# EAGLE design Placa 20.1.1 (EAGLE 9.4.2)

## Sheet 1 of 2
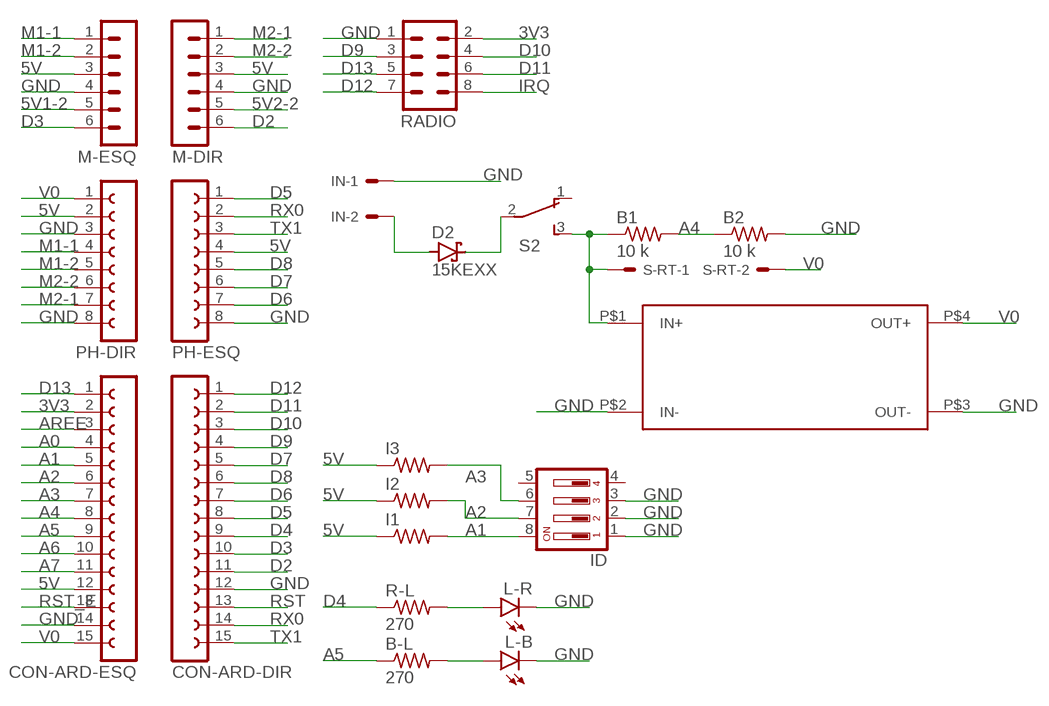
[diagram p0: schematic, sheet 1]

### Parts
B1  10 k  R-US_0207/10  [0207/10]
B2  10 k  R-US_0207/10  [0207/10]
B-L  270  R-US_0207/10  [0207/10]
CON-ARD-DIR  FE15-1  [FE15]
CON-ARD-ESQ  FE15-1  [FE15]
D2  15KEXX  [CB429-17]
I1  R-US_0207/10  [0207/10]
I2  R-US_0207/10  [0207/10]
I3  R-US_0207/10  [0207/10]
ID  DA04  [DA-04]
IN  332-02  [332-02]
L-B  LED5MM  [LED5MM]
L-R  LED5MM  [LED5MM]
M-DIR  MA06-1  [MA06-1]
M-ESQ  MA06-1  [MA06-1]
PH-DIR  FE08-1  [FE08]
PH-ESQ  FE08-1  [FE08]
R-L  270  R-US_0207/10  [0207/10]
RADIO  MA04-2  [MA04-2]
REGULADOR-DE-TENSÃO  REGULADOR  [REGULADOR-FP]
S2  TL36YO  [TL3XYO]
S-RT  332-02  [332-02]

### Nets
3V3: CON-ARD-ESQ.2 RADIO.2
5V: CON-ARD-ESQ.12 I1.1 I2.1 I3.1 M-DIR.3 M-ESQ.3 PH-DIR.2 PH-ESQ.4
5V1-2: M-ESQ.5
5V2-2: M-DIR.5
A0: CON-ARD-ESQ.4
A1: CON-ARD-ESQ.5 I1.2 ID.8
A2: CON-ARD-ESQ.6 I2.2 ID.7
A3: CON-ARD-ESQ.7 I3.2 ID.6
A4: B1.2 B2.1 CON-ARD-ESQ.8
A5: B-L.1 CON-ARD-ESQ.9
A6: CON-ARD-ESQ.10
A7: CON-ARD-ESQ.11
AREE: CON-ARD-ESQ.3
D2: CON-ARD-DIR.11 M-DIR.6
D3: CON-ARD-DIR.10 M-ESQ.6
D4: CON-ARD-DIR.9 R-L.1
D5: CON-ARD-DIR.8 PH-ESQ.1
D6: CON-ARD-DIR.7 PH-ESQ.7
D7: CON-ARD-DIR.5 PH-ESQ.6
D8: CON-ARD-DIR.6 PH-ESQ.5
D9: CON-ARD-DIR.4 RADIO.3
D10: CON-ARD-DIR.3 RADIO.4
D11: CON-ARD-DIR.2 RADIO.6
D12: CON-ARD-DIR.1 RADIO.7
D13: CON-ARD-ESQ.1 RADIO.5
GND: B2.2 CON-ARD-DIR.12 CON-ARD-ESQ.14 ID.1 ID.2 ID.3 IN.1 L-B.K(C) L-R.K(C) M-DIR.4 M-ESQ.4 PH-DIR.3 PH-DIR.8 PH-ESQ.8 RADIO.1 REGULADOR-DE-TENSÃO.P$2(IN-) REGULADOR-DE-TENSÃO.P$3(OUT-)
IRQ: RADIO.8
M1-1: M-ESQ.1 PH-DIR.4
M1-2: M-ESQ.2 PH-DIR.5
M2-1: M-DIR.1 PH-DIR.7
M2-2: M-DIR.2 PH-DIR.6
N$1: D2.A IN.2
N$2: D2.C S2.2(P)
N$3: B1.1 REGULADOR-DE-TENSÃO.P$1(IN+) S2.3(S) S-RT.1
N$4: L-R.A R-L.2
N$5: B-L.2 L-B.A
RST: CON-ARD-DIR.13
RST_E: CON-ARD-ESQ.13
RX0: CON-ARD-DIR.14 PH-ESQ.2
TX1: CON-ARD-DIR.15 PH-ESQ.3
V0: CON-ARD-ESQ.15 PH-DIR.1 REGULADOR-DE-TENSÃO.P$4(OUT+) S-RT.2
Unconnected: ID.4 ID.5 S2.1(O)

## Sheet 2 of 2

## Library data of the parts
B1 B2 B-L I1-I3 R-L = rcl:R-US_: RESISTOR, American symbol; SPICEPREFIX: R
CON-ARD-DIR = con-lsta:FE15-1: FEMALE HEADER; OC_FARNELL: unknown; OC_NEWARK: unknown
CON-ARD-ESQ = con-lsta:FE15-1: FEMALE HEADER; OC_FARNELL: unknown; OC_NEWARK: unknown; SPICEPREFIX: X
D2 = diode:15KEXX: DIODE
ID = switch-dil:DA04: DIL/CODE SWITCH; MPN: MCDA04; OC_FARNELL: 9471545; OC_NEWARK: 26M1090
IN S-RT = con-garry:332-02: 2 Pin - 2mm Dual Row Source: www.mpe-connector.de / garry_shortform_2012.pdf
L-B L-R = led:LED: LED OSRAM: - CHIPLED LG R971, LG N971, LY N971, LG Q971, LY Q971, LO R971, LY R971 LH N974, LH R974 LS Q976, LO Q976, LY Q976 LO Q996 - Hyper CHIPLED LW Q18S LB Q993, LB Q99A, LB R99A - SideLED LS A670, LO A670, LY A670, LG A670, LP A670 LB A673, LV A673, LT A673, LW A673 LH A674 LY A675 LS A676, LA A676, LO A676, LY A676, LW A676 LS A679, LY A679, LG A679 - Hyper Micro SIDELED® LS Y876, LA Y876, LO Y876, LY Y876 LT Y87S - SmartLED LW L88C, LW L88S LB L89C, LB L89S, LG L890 LS L89K, LO L89K, LY L89K LS L896, LA L896, LO L896, LY L896 - TOPLED LS T670, LO T670, LY T670, LG T670, LP T670 LSG T670, LSP T670, LSY T670, LOP T670, LYG T670 LG T671, LOG T671, LSG T671 LB T673, LV T673, LT T673, LW T673 LH T674 LS T676, LA T676, LO T676, LY T676, LB T676, LH T676, LSB T676, LW T676 LB T67C, LV T67C, LT T67C, LS T67K, LO T67K, LY T67K, LW E67C LS E67B, LA E67B, LO E67B, LY E67B, LB E67C, LV E67C, LT E67C LW T67C LS T679, LY T679, LG T679 LS T770, LO T770, LY T770, LG T770, LP T770 LB T773, LV T773, LT T773, LW T773 LH T774 LS E675, LA E675, LY E675, LS T675 LS T776, LA T776, LO T776, LY T776, LB T776 LHGB T686 LT T68C, LB T68C - Hyper Mini TOPLED® LB M676 - Mini TOPLED Santana® LG M470 LS M47K, LO M47K, LY M47K Source: http://www.osram.convergy.de LUXEON: - LUMILED® LXK2-PW12-R00, LXK2-PW12-S00, LXK2-PW14-U00, LXK2-PW14-V00 LXK2-PM12-R00, LXK2-PM12-S00, LXK2-PM14-U00 LXK2-PE12-Q00, LXK2-PE12-R00, LXK2-PE12-S00, LXK2-PE14-T00, LXK2-PE14-U00 LXK2-PB12-K00, LXK2-PB12-L00, LXK2-PB12-M00, LXK2-PB14-N00, LXK2-PB14-P00, LXK2-PB14-Q00 LXK2-PR12-L00, LXK2-PR12-M00, LXK2-PR14-Q00, LXK2-PR14-R00 LXK2-PD12-Q00, LXK2-PD12-R00, LXK2-PD12-S00 LXK2-PH12-R00, LXK2-PH12-S00 LXK2-PL12-P00, LXK2-PL12-Q00, LXK2-PL12-R00 Source: www.luxeon.com KINGBRIGHT: KA-3528ASYC Source: www.kingbright.com
M-DIR M-ESQ = con-lstb:MA06-1: PIN HEADER; OC_FARNELL: unknown; OC_NEWARK: unknown
PH-DIR PH-ESQ = con-lsta:FE08-1: FEMALE HEADER; OC_FARNELL: unknown; OC_NEWARK: unknown
RADIO = con-lstb:MA04-2: PIN HEADER; OC_FARNELL: unknown; OC_NEWARK: unknown
REGULADOR-DE-TENSÃO = robo-bdp:REGULADOR
S2 = switch:TL36YO: TINY SWITCH ON - ON Source: http://www2.produktinfo.conrad.com/datenblaetter/700000-724999/705152-da-01-de-Subminiaturschalter_TL_36YO.pdf

## Net classes
0 default: width 1 mm
1 VCC: width 1 mm

## Board
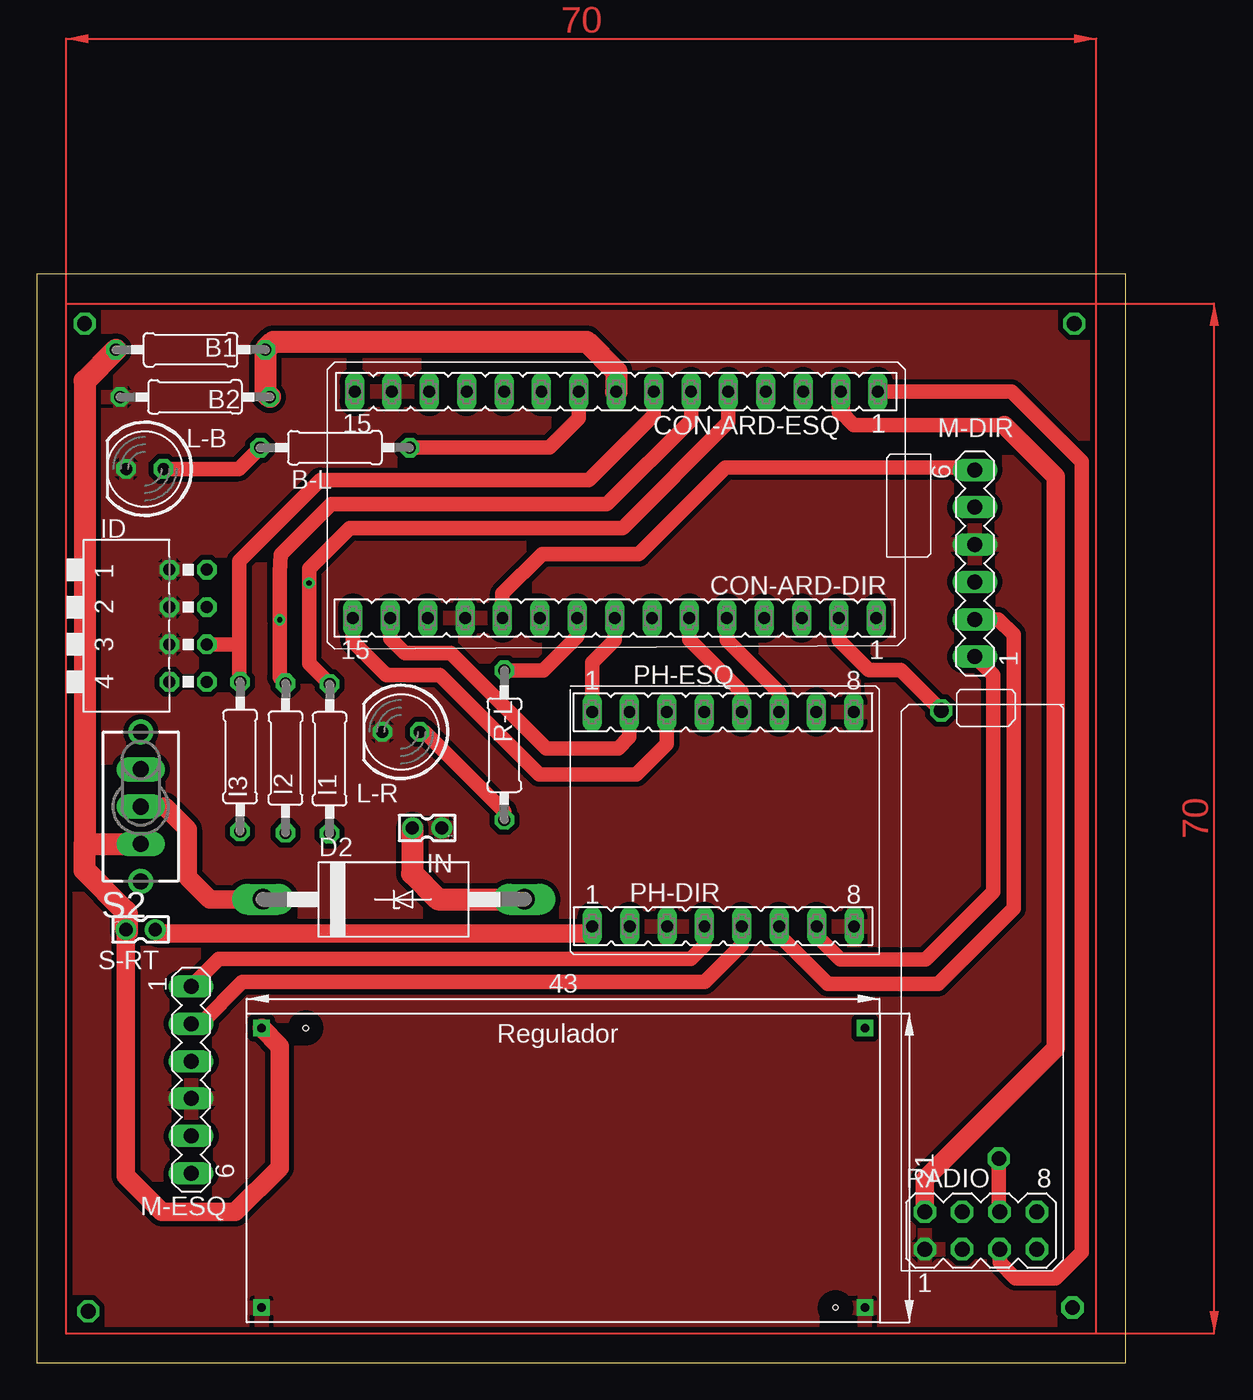
[diagram p1: board, top side]
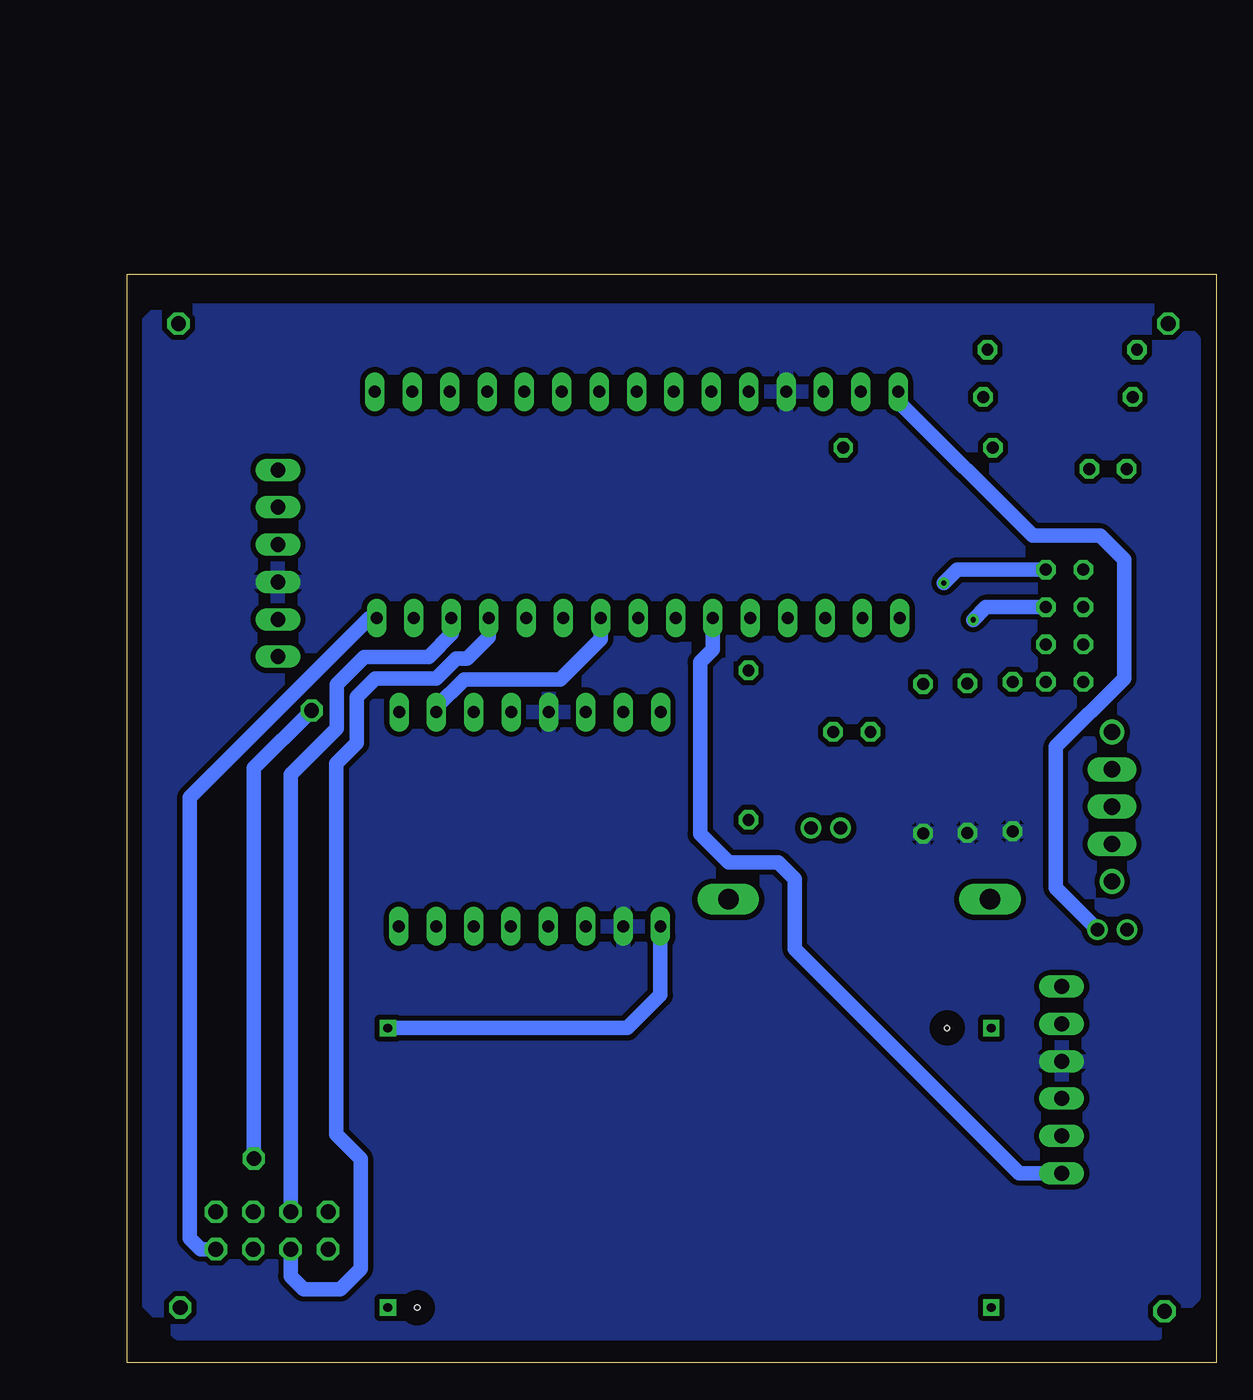
[diagram p2: board, bottom side, seen from below]

Size 74 x 74 mm. Coordinates in mm from the lower left corner, seen from the top.
Outline: 0,0 74,0 74,74 0,74 0,0
Copper layers (1*16): Top 0.035mm / dielectric 1.5mm / Bottom 0.035mm
Design rules "default *": minimum track width 6mil, minimum drill 0.35mm, track to track 14mil, track to pad 14mil, pad to pad 14mil, via to via 14mil, smd to smd 14mil, copper to edge 40mil, drill to drill 6mil, minimum pad ring 10mil, minimum via ring 8mil, stop-mask expansion 4mil, vias tented up to drill 0mil, thermal gap 10mil

### Footprints (pad centres in the part's own frame; a part is rotated, then mirrored left to right if it is on the bottom)
0207/10 = drill 0.813 octagon: 1 -5.08,0; 2 5.08,0
FE15 = drill 0.813 long: 1 -17.78,0; 2 -15.24,0; 3 -12.7,0; 4 -10.16,0; 5 -7.62,0; 6 -5.08,0; 7 -2.54,0; 8 0,0; 9 2.54,0; 10 5.08,0; 11 7.62,0; 12 10.16,0; 13 12.7,0; 14 15.24,0; 15 17.78,0
CB429-17 = drill 1.397 long: A 8.89,0; C -8.89,0
DA-04 = drill 0.813 octagon: 1 -3.81,-1.27; 2 -1.27,-1.27; 3 1.27,-1.27; 4 3.81,-1.27; 5 3.81,1.27; 6 1.27,1.27; 7 -1.27,1.27; 8 -3.81,1.27
332-02 = drill 0.9 pad 1.27: 1 0,-1; 2 0,1
LED5MM = drill 0.813 octagon: A -1.27,0; K 1.27,0
MA06-1 = drill 1.016 long: 1 -6.35,0; 2 -3.81,0; 3 -1.27,0; 4 1.27,0; 5 3.81,0; 6 6.35,0
FE08 = drill 0.813 long: 1 -8.89,0; 2 -6.35,0; 3 -3.81,0; 4 -1.27,0; 5 1.27,0; 6 3.81,0; 7 6.35,0; 8 8.89,0
MA04-2 = drill 1.016 octagon: 1 -3.81,-1.27; 2 -3.81,1.27; 3 -1.27,-1.27; 4 -1.27,1.27; 5 1.27,-1.27; 6 1.27,1.27; 7 3.81,-1.27; 8 3.81,1.27
REGULADOR-FP = drill 0.6 square: P$1 -19,3; P$2 -19,-16; P$3 22,-16; P$4 22,3 | hole 0.35: -16,3; 20,-16
TL3XYO = drill 1.1 pad 1.422 long: 1 -2.54,0; 2 0,0; 3 2.54,0 | drill 1.1 pad 1.676: M1 -5.08,0; M2 5.08,0

### Placement (x,y rotation side)
B1  10.45,68.85 0 top
B2  10.75,65.65 180 top
B-L  20.25,62.2 180 top
CON-ARD-DIR  39.26,50.62 180 top
CON-ARD-ESQ  39.37,66.01 180 top
D2  24.25,31.5 0 top
I1  19.9,41.05 90 top
I2  16.9,41.1 90 top
I3  13.82,41.2 90 top
ID  10.29,50.09 270 top
IN  26.52,36.35 90 top
L-B  7.34,60.76 180 top
L-R  24.75,42.88 180 top
M-DIR  63.74,54.34 90 top
M-ESQ  10.49,19.23 270 top
PH-DIR  46.64,29.67 0 top
PH-ESQ  46.62,44.23 0 top
R-L  31.77,41.98 270 top
RADIO  64.15,8.99 0 top
REGULADOR-DE-TENSÃO  34.27,19.75 0 top
S2  7.06,37.8 270 top
S-RT  7.06,29.44 270 top

### Tracks (layer width: path | path; a pad name or v marks a point on that pad's centre or on a via)
3V3
  Top 1: 54.61,64.64 55.5,63.75 65.75,63.75
  Top 1.27: 54.61,64.64 CON-ARD-ESQ.2 | 65.75,63.75 69.25,60.25 69.25,21.38 60.34,12.46 RADIO.2
5V
  pour Bottom: 4,2 70.5,2 73,4.5 73,70.25 71.75,71.5 3.5,71.5 1.5,69.5 1.5,4.5
A1  (via drill 0.35)
  Top 1: CON-ARD-ESQ.5 46.99,63.92 39.82,56.75 21.25,56.75 18.5,54 v18.5,53 18.5,47.53 I1.2
  Bottom 1: v18.5,53 17.6,53.9 ID.8
A2  (via drill 0.35)
  Top 1: CON-ARD-ESQ.6 44.45,64.09 38.74,58.38 20,58.38 16.56,54.94 16.5,53.75 v16.5,50.5 16.5,46.58 I2.2
  Bottom 1: ID.7 15.64,51.36 v16.5,50.5
A3
  Top 1: CON-ARD-ESQ.7 41.91,64.41 37.5,60 19.25,60 13.75,54.5 13.75,49 | 13.75,49 13.75,46.35 I3.2 | ID.6 13.57,48.82 13.75,49
A4
  Top 1.5: B2.1 15.53,65.95 B1.2 16.07,69.39 37.36,69.39 39.38,67.38 CON-ARD-ESQ.8
A5
  Top 1: CON-ARD-ESQ.9 36.83,64.21 34.82,62.2 B-L.1
D2
  Top 1: CON-ARD-DIR.11 31.64,52.27 34.34,54.97 40.91,54.97 46.78,60.84 63.59,60.84 M-DIR.6
D3
  Bottom 1: M-ESQ.6 13.38,12.88 28.62,28.12 28.62,32.88 29.75,34 33.12,34 35.06,35.93 35.06,47.62 34.18,48.49 CON-ARD-DIR.10
D4
  Top 1: CON-ARD-DIR.9 36.72,49.37 34.42,47.06 R-L.1
D5
  Top 1: CON-ARD-DIR.8 39.26,49.12 37.73,47.59 PH-ESQ.1
D6
  Bottom 1: CON-ARD-DIR.7 41.8,49.2 44.55,46.45 51.08,46.45 52.97,44.56 PH-ESQ.7
D7
  Top 1: CON-ARD-DIR.5 46.88,49.12 50.43,45.57 PH-ESQ.6
D8
  Top 1: CON-ARD-DIR.6 44.34,49.16 47.89,45.61 PH-ESQ.5
D9
  Bottom 1: RADIO.3 62.88,5.88 62,5 59.5,5 58.12,6.38 58.12,13.88 59.77,15.52 59.77,40.73 58.38,42.12 58.38,45.25 57.12,46.5 53,46.5 51.64,47.86 50.89,47.86 49.42,49.33 CON-ARD-DIR.4
D10
  Bottom 1: RADIO.4 62.88,39.99 59.76,43.12 59.76,46.11 57.88,47.98 53.51,47.98 51.94,49.56 51.94,50.59 CON-ARD-DIR.3
D11  (via drill 1, 1 pad 1.3)
  Top 1: v61.46,44.33 58.71,47.08 56.54,47.08 54.5,49.12 CON-ARD-DIR.2 | v65.38,13.88 65.38,10.3 RADIO.6
  Bottom 1: v61.46,44.33 65.38,40.42 v65.38,13.88
D12
  Bottom 1: RADIO.7 69,7.72 69.75,8.47 69.75,38.41 57.54,50.62 CON-ARD-DIR.1
D13
  Top 1: CON-ARD-ESQ.1 66.24,66.01 71,61.25 71,7.5 69.25,5.75 66.5,5.75 65.42,6.83 RADIO.5
GND
  pour Top: 4,2 70.5,2 73,4.5 73,70.5 72,71.5 3.5,71.5 2,70 2,4
M1-1
  Top 1: M-ESQ.1 12.37,27.45 44.45,27.45 45.37,28.37 PH-DIR.4
M1-2
  Top 1: PH-DIR.5 47.91,28.41 45.38,25.88 13.96,25.88 11.12,23.04 M-ESQ.2
M2-1
  Top 1: PH-DIR.7 52.99,29.01 54.59,27.41 60.41,27.41 64.99,31.99 64.99,46.74 M-DIR.1
M2-2
  Top 1: PH-DIR.6 50.45,29.05 53.75,25.75 61.25,25.75 66.38,30.88 66.38,49.5 65.34,50.53 M-DIR.2
N$1
  Top 1.5: IN.2 25.52,33.27 25.5,33.25 27.25,31.5 D2.A
N$2
  Top 1: S2.2 8.7,37.8
  Top 1.27: 8.7,37.8 10.25,36.25 10.25,33 11.75,31.5 D2.C
N$3
  Top 1: S-RT.1 6.25,29.24
  Top 1.27: 6.06,30.69 6.25,30.49 6.25,29.24 | S-RT.1 6.06,12.69 8.5,10.25 13.5,10.25 16.5,13.25 16.5,21.52 REGULADOR-DE-TENSÃO.P$1
  Top 1.5: S-RT.1 6.06,30.69 3.26,33.49 3.26,35.26 | 3.26,35.26 S2.3 | 3.26,35.26 3.26,66.74 B1.1
N$4
  Top 1: R-L.2 31.77,37.48 26.36,42.88 L-R.A
N$5
  Top 1: L-B.A 13.73,60.76 B-L.2
N$6  (via drill 1)
  other vias: 3.25,70.62
N$7  (via drill 1 pad 1)
  other vias: 70.5,70.62
N$8  (via drill 1 pad 1)
  other vias: 3.5,3.5
N$9  (via drill 1)
  other vias: 70.38,3.75
RX0
  Top 1: CON-ARD-DIR.14 24.02,49.23 25,48.25 28.12,48.25 34.62,41.75 39.5,41.75 40.27,42.52 PH-ESQ.2
TX1
  Top 1: PH-ESQ.3 42.81,42.06 40.75,40 34.14,40 27.39,46.75 23.75,46.75 21.48,49.02 CON-ARD-DIR.15
V0
  Top 1: 37.27,29.19 PH-DIR.1
  Top 1.27: 37.27,29.19 8.31,29.19 S-RT.2
  Bottom 1: REGULADOR-DE-TENSÃO.P$4 40,22.75 37.75,25 PH-DIR.1 | S-RT.2 10.88,32.26 10.88,41.88 6.25,46.5 6.25,54.6 7.87,56.22 12.47,56.22 21.59,65.34 CON-ARD-ESQ.15
(copper drawn outside any net)
  shapes: Top area x2